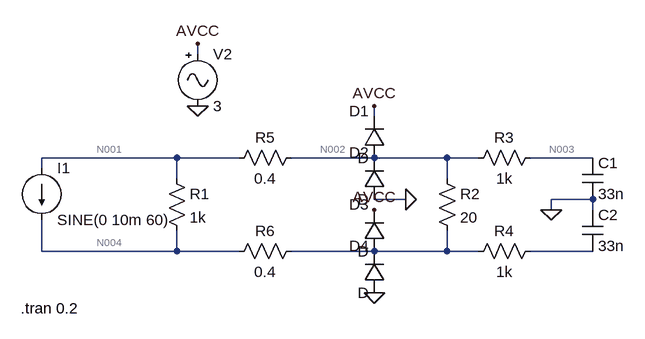
[diagram p0: schematic Current_Detect_Schematic.asc]
Current_Detect_Schematic.asc, the LTspice schematic file:
Version 4
SHEET 1 880 680
WIRE -16 -48 -16 -64
WIRE 256 48 256 32
WIRE -48 112 -256 112
WIRE 48 112 -48 112
WIRE 256 112 128 112
WIRE 368 112 256 112
WIRE 416 112 368 112
WIRE 592 112 496 112
WIRE -256 128 -256 112
WIRE -48 144 -48 112
WIRE 368 144 368 112
WIRE 304 176 256 176
WIRE 592 176 528 176
WIRE 528 192 528 176
WIRE 592 192 592 176
WIRE -256 256 -256 208
WIRE -48 256 -48 224
WIRE -48 256 -256 256
WIRE 48 256 -48 256
WIRE 256 256 128 256
WIRE 368 256 368 224
WIRE 368 256 256 256
WIRE 416 256 368 256
WIRE 592 256 496 256
FLAG 256 320 0
FLAG 304 176 0
FLAG 528 192 0
FLAG -16 -64 AVCC
FLAG 256 32 AVCC
FLAG 256 192 AVCC
FLAG -16 32 0
SYMBOL res -64 128 R0
SYMATTR InstName R1
SYMATTR Value 1k
SYMATTR SpiceLine tol=5
SYMBOL res 352 128 R0
SYMATTR InstName R2
SYMATTR Value 20
SYMATTR SpiceLine tol=5
SYMBOL res 400 128 R270
WINDOW 0 32 56 VTop 0
WINDOW 3 0 56 VBottom 0
SYMATTR InstName R3
SYMATTR Value 1k
SYMATTR SpiceLine tol=5
SYMBOL res 512 240 R90
WINDOW 0 0 56 VBottom 0
WINDOW 3 32 56 VTop 0
SYMATTR InstName R4
SYMATTR Value 1k
SYMATTR SpiceLine tol=5
SYMBOL cap 576 112 R0
SYMATTR InstName C1
SYMATTR Value 33n
SYMBOL cap 576 192 R0
SYMATTR InstName C2
SYMATTR Value 33n
SYMBOL diode 272 112 R180
WINDOW 0 24 72 Left 0
WINDOW 3 24 0 Left 0
SYMATTR InstName D1
SYMBOL diode 272 176 R180
WINDOW 0 24 72 Left 0
WINDOW 3 24 0 Left 0
SYMATTR InstName D2
SYMBOL diode 272 256 R180
WINDOW 0 24 72 Left 0
WINDOW 3 24 0 Left 0
SYMATTR InstName D3
SYMBOL diode 272 320 R180
WINDOW 0 24 72 Left 0
WINDOW 3 24 0 Left 0
SYMATTR InstName D4
SYMBOL Misc\\signal -16 -64 R0
WINDOW 123 0 0 Left 0
WINDOW 39 0 0 Left 0
SYMATTR InstName V2
SYMATTR Value 3
SYMBOL res 144 96 R90
WINDOW 0 0 56 VBottom 0
WINDOW 3 32 56 VTop 0
SYMATTR InstName R5
SYMATTR Value 0.4
SYMATTR SpiceLine tol=5
SYMBOL res 144 240 R90
WINDOW 0 0 56 VBottom 0
WINDOW 3 32 56 VTop 0
SYMATTR InstName R6
SYMATTR Value 0.4
SYMATTR SpiceLine tol=5
SYMBOL current -256 128 R0
WINDOW 123 0 0 Left 0
WINDOW 39 0 0 Left 0
SYMATTR InstName I1
SYMATTR Value SINE(0 10m 60)
TEXT -288 344 Left 0 !.tran 0.2

The netlist it stands for:
* Current_Detect_Schematic.asc
R1 N001 N004 1k tol=5
R2 N002 N005 20 tol=5
R3 N002 N003 1k tol=5
R4 N006 N005 1k tol=5
C1 N003 0 33n
C2 0 N006 33n
D1 N002 AVCC D
D2 0 N002 D
D3 N005 AVCC D
D4 0 N005 D
V2 AVCC 0 3
R5 N002 N001 0.4 tol=5
R6 N005 N004 0.4 tol=5
I1 N001 N004 SINE(0 10m 60)
.model D D
.lib standard.dio
.tran 0.2
.backanno
.end

* Results of the author's LTspice run, read from the files saved beside the schematic
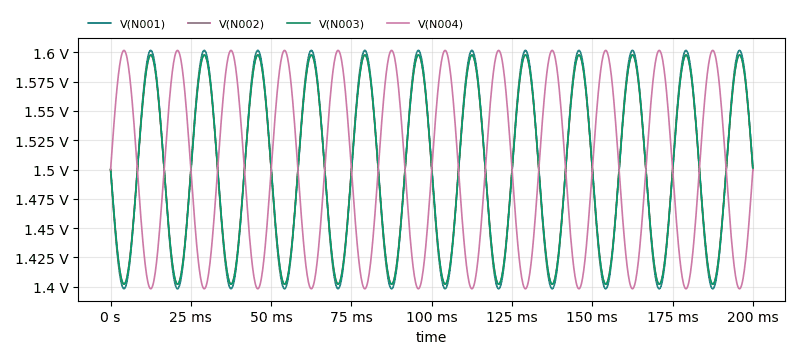
[diagram p1: Transient Analysis of Current_Detect_Schematic.asc, plotted from the saved traces]
* Transient Analysis, 1 run:
*   V(N001): min 1.398 V, max 1.602 V, average 1.5 V, rms 1.502 V, last 1.5 V
*   V(N002): min 1.402 V, max 1.598 V, average 1.5 V, rms 1.502 V, last 1.5 V
*   V(N003): min 1.402 V, max 1.598 V, average 1.5 V, rms 1.502 V, last 1.501 V
*   V(N004): min 1.398 V, max 1.602 V, average 1.5 V, rms 1.502 V, last 1.5 V